# EAGLE design BPU_display-v1d.2-28inch (EAGLE 9.1.3)
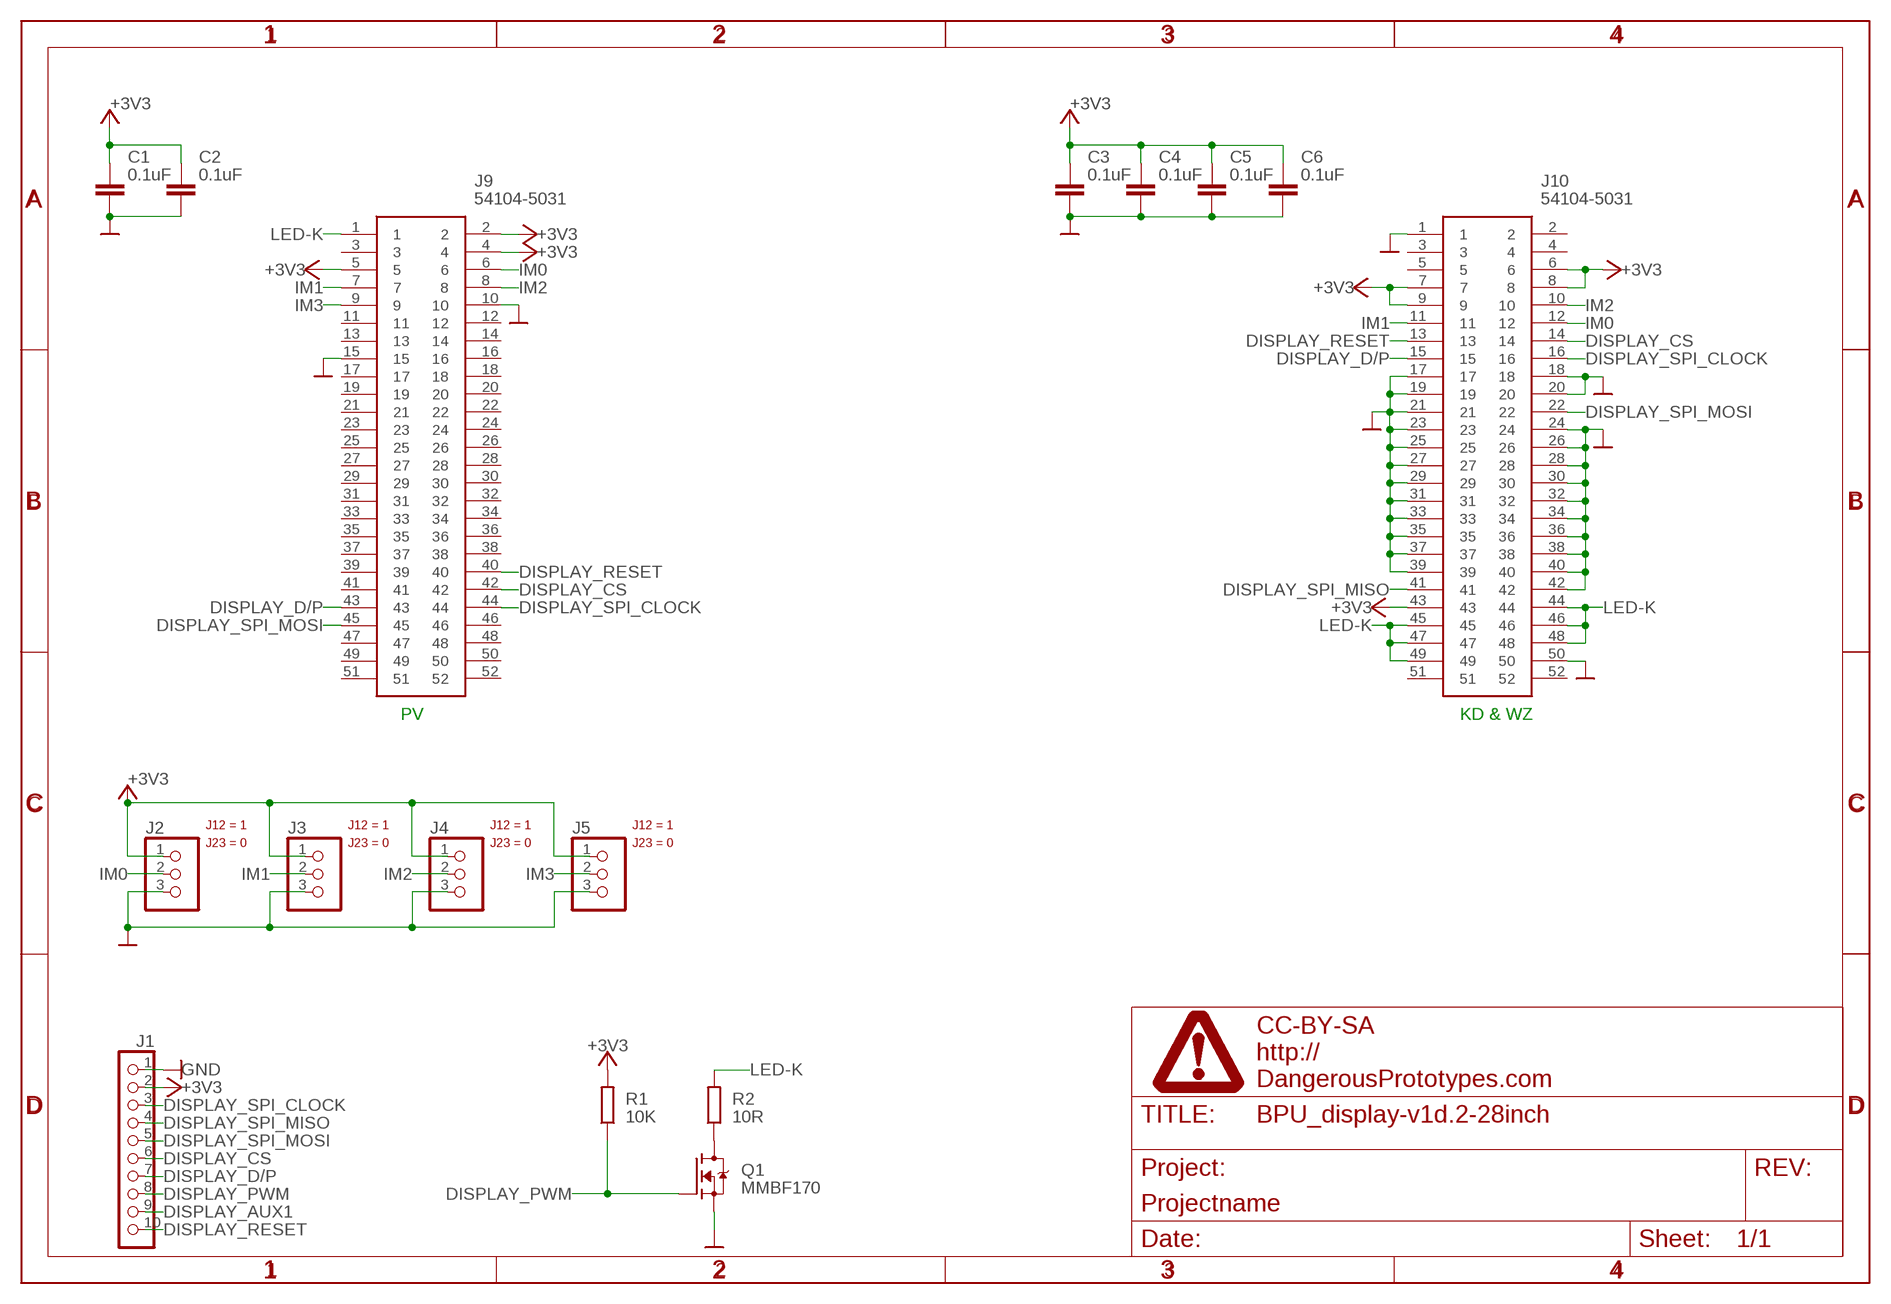
[diagram p0: schematic, sheet 1]

## Parts
C1  0.1uF  CAPACITOR_NPOL-0603  [C603]
C2  0.1uF  CAPACITOR_NPOL-0603  [C603]
C3  0.1uF  CAPACITOR_NPOL-0603  [C603]
C4  0.1uF  CAPACITOR_NPOL-0603  [C603]
C5  0.1uF  CAPACITOR_NPOL-0603  [C603]
C6  0.1uF  CAPACITOR_NPOL-0603  [C603]
J1  CON-FPC_X05B20L10T  [X05B20L10T]
J2  JUMPER_1X30805  [JP3_0805]
J3  JUMPER_1X30805  [JP3_0805]
J4  JUMPER_1X30805  [JP3_0805]
J5  JUMPER_1X30805  [JP3_0805]
J9  54104-5031  [541045031]
J10  54104-5031  [541045031]
PAGE1  FRAME_DINA4_L  [DP_LOGO]
Q1  MMBF170  TRANSISTOR_FET_BS170-SOT-23  [SOT-23]
R1  10K  R-EU_R0603  [R0603]
R2  10R  R-EU_R0603  [R0603]

## Nets
+3V3: C1.1 C2.1 C3.1 C4.1 C5.1 C6.1 J1.2 J2.1 J3.1 J4.1 J5.1 J9.2 J9.4 J9.5 J10.6 J10.7 J10.8 J10.9 J10.43 R1.2 ; supply symbol labelled SUPPLY_+3V3
DISPLAY_AUX1 [signal_digital]: J1.9
DISPLAY_CS: J1.6 J9.42 J10.14
DISPLAY_D/P: J1.7 J9.43 J10.15
DISPLAY_PWM: J1.8 Q1.1(G) R1.1
DISPLAY_RESET [signal_digital]: J1.10 J9.40 J10.13
DISPLAY_SPI_CLOCK: J1.3 J9.44 J10.16
DISPLAY_SPI_MISO: J1.4 J10.41
DISPLAY_SPI_MOSI: J1.5 J9.45 J10.22
GND: C1.2 C2.2 C3.2 C4.2 C5.2 C6.2 J1.1 J2.3 J3.3 J4.3 J5.3 J9.10 J9.15 J10.1 J10.17 J10.18 J10.19 J10.20 J10.21 J10.23 J10.24 J10.25 J10.26 J10.27 J10.28 J10.29 J10.30 J10.31 J10.32 J10.33 J10.34 J10.35 J10.36 J10.37 J10.38 J10.39 J10.40 J10.42 J10.50 Q1.2(S) ; supply symbol labelled SUPPLY_GND
IM0: J2.2 J9.6 J10.12
IM1: J3.2 J9.7 J10.11
IM2: J4.2 J9.8 J10.10
IM3: J5.2 J9.9
LED-K: J9.1 J10.44 J10.45 J10.46 J10.47 J10.48 J10.49 R2.2
N$2: Q1.3(D) R2.1
Unconnected: J9.3 J9.11 J9.12 J9.13 J9.14 J9.16 J9.17 J9.18 J9.19 J9.20 J9.21 J9.22 J9.23 J9.24 J9.25 J9.26 J9.27 J9.28 J9.29 J9.30 J9.31 J9.32 J9.33 J9.34 J9.35 J9.36 J9.37 J9.38 J9.39 J9.41 J9.46 J9.47 J9.48 J9.49 J9.50 J9.51 J9.52 J10.2 J10.3 J10.4 J10.5 J10.51 J10.52

## Notes on the sheet
- PV | KD & WZ

## Library data of the parts
C1-C6 = dp_devices.v6:CAPACITOR_NPOL: Non-Polarized capacitor in various packages
J1 = dp_devices.v6:CON-FPC_X05B20L10T: 10-pin 0.5mm pitch SMD FPC Connector X05B20L10T
J2-J5 = dp_devices.v6:JUMPER_1X3; J12: 1; J23: 0
J9 J10 = SamacSys_Parts:54104-5031: Connector 0.5mm, FFC/FPC, SMT,r/a,50w,Au Molex FFC/FPC SMT Series 0.5mm Pitch 50 Way Right Angle SMT Female FPC Connector, ZIF Top Contact Source: Datasheet <https://componentsearchengine.com/Datasheets/1/54104-5031.pdf>; DESCRIPTION: Connector 0.5mm, FFC/FPC, SMT,r/a,50w,Au Molex FFC/FPC SMT Series 0.5mm Pitch 50 Way Right Angle SMT Female FPC Connector, ZIF Top Contact; HEIGHT: 2mm; MANUFACTURER_NAME: Molex; MANUFACTURER_PART_NUMBER: 54104-5031; MOUSER_PART_NUMBER: 538-54104-5031; MOUSER_PRICE-STOCK: https://www.mouser.com/Search/Refine.aspx?Keyword=538-54104-5031
PAGE1 = dp_devices.v6:FRAME_DINA4_L: A4 DP frame Standard Dangerous Prototypes schematic frame. Automagically adds the DP logo and standard texts to the PCB Use the atrribute in the schematic editor to change the fields.; FF1: fulfillment by; FF2: Seeed Studio; FF3: www.seeedstudio.com; LICENSE: CC-BY-SA; PROJECT: Projectname; URL1: http://; URL2: DangerousPrototypes.com
Q1 = dp_devices.v6:TRANSISTOR_FET_BS170: N-Channel Enhancement Mode Field Effect Transistor
R1 R2 = rcl:R-EU_: RESISTOR, European symbol; SPICEPREFIX: R

## Net classes
1 power: width 0.305 mm
3 signal_digital: width 0.254 mm

## Board
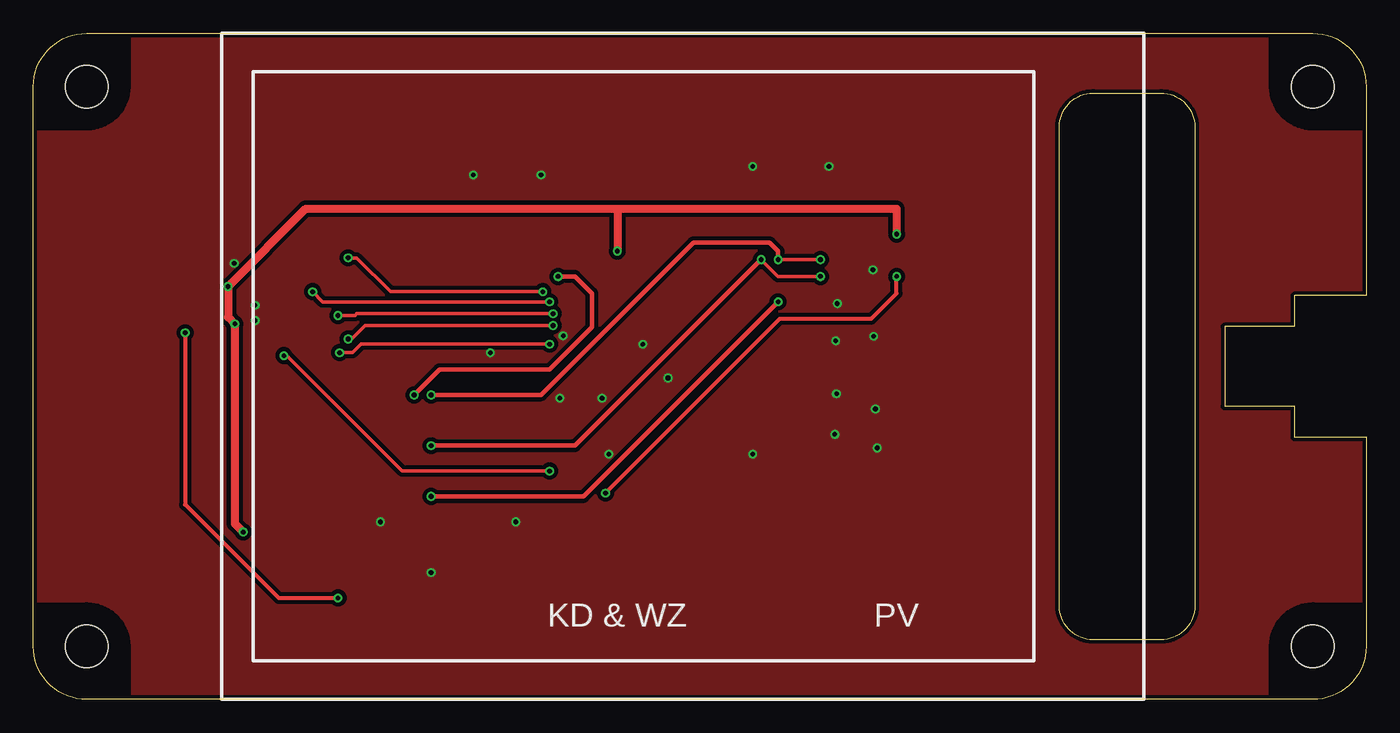
[diagram p1: board, top side]
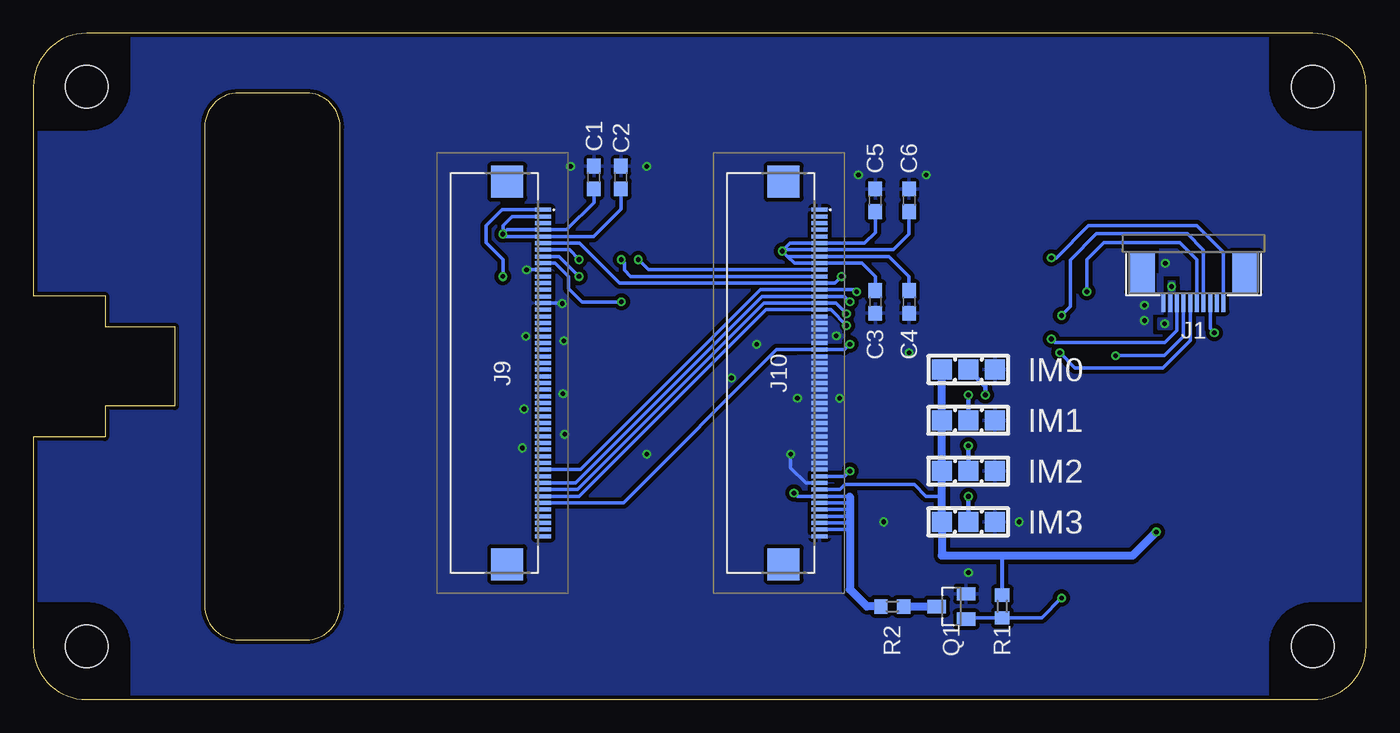
[diagram p2: board, bottom side, seen from below]

Size 100 x 50 mm. Coordinates in mm from the lower left corner, seen from the top.
Outline: 100,4 arc0 100,4
Outline: 100,4 arc-90 96,0 4,0 arc-90 0,4 0,46 arc-90 4,50 96,50 arc-90 100,46 100,30.31 94.62,30.31 94.62,27.98 89.39,27.98 89.39,22.02 94.62,22.02 94.62,19.69 100,19.69 100,4
Outline: 79.52,45.52 84.6,45.52 arc-90 87.14,42.98 87.14,7.03 arc-90 84.6,4.49 79.52,4.49 arc-90 76.98,7.03 76.98,42.98 arc-90 79.52,45.52
Copper layers (1*16): Top 0.035mm / dielectric 1.5mm / Bottom 0.035mm
Design rules "dirt_cheap_dirty_boards.v1.1": minimum track width 6mil, minimum drill 12mil, track to track 6mil, track to pad 6mil, pad to pad 6mil, via to via 6mil, smd to smd 0mil, copper to edge 10mil, drill to drill 10mil, minimum pad ring 10mil, minimum via ring 6mil, stop-mask expansion 2mil, vias tented up to drill 25mil, thermal gap 10mil
Holes 3.2 mm at 4,4 96,4 96,46 4,46
tKeepout: 7 lines
bKeepout: 8 lines
tRestrict: area 0,43 to 7,50; area 93,43 to 100,50; area 0,0 to 7,7; area 93,0 to 100,7
bRestrict: area 0,43 to 7,50; area 93,43 to 100,50; area 0,0 to 7,7; area 93,0 to 100,7
vRestrict: area 0,0 to 7,7; area 0,43 to 7,50; area 93,43 to 100,50; area 93,0 to 100,7

### Footprints (pad centres in the part's own frame; a part is rotated, then mirrored left to right if it is on the bottom)
C603 = smd 1.1 x 1: 1 -0.85,0; 2 0.85,0
X05B20L10T = smd 0.3 x 1.3: 1 2.25,2.35; 2 1.75,2.35; 3 1.25,2.35; 4 0.75,2.35; 5 0.25,2.35; 6 -0.25,2.35; 7 -0.75,2.35; 8 -1.25,2.35; 9 -1.75,2.35; 10 -2.25,2.35 | smd 2 x 3: 11 -3.9,0; 12 3.9,0
JP3_0805 = smd 1.5 x 1.5: 1 -2,0; 2 0,0; 3 2,0
541045031 = smd 0.3 x 1.2: 1 -12.25,0.4; 2 -11.75,0.4; 3 -11.25,0.4; 4 -10.75,0.4; 5 -10.25,0.4; 6 -9.75,0.4; 7 -9.25,0.4; 8 -8.75,0.4; 9 -8.25,0.4; 10 -7.75,0.4; 11 -7.25,0.4; 12 -6.75,0.4; 13 -6.25,0.4; 14 -5.75,0.4; 15 -5.25,0.4; 16 -4.75,0.4; 17 -4.25,0.4; 18 -3.75,0.4; 19 -3.25,0.4; 20 -2.75,0.4; 21 -2.25,0.4; 22 -1.75,0.4; 23 -1.25,0.4; 24 -0.75,0.4; 25 -0.25,0.4; 26 0.25,0.4; 27 0.75,0.4; 28 1.25,0.4; 29 1.75,0.4; 30 2.25,0.4; 31 2.75,0.4; 32 3.25,0.4; 33 3.75,0.4; 34 4.25,0.4; 35 4.75,0.4; 36 5.25,0.4; 37 5.75,0.4; 38 6.25,0.4; 39 6.75,0.4; 40 7.25,0.4; 41 7.75,0.4; 42 8.25,0.4; 43 8.75,0.4; 44 9.25,0.4; 45 9.75,0.4; 46 10.25,0.4; 47 10.75,0.4; 48 11.25,0.4; 49 11.75,0.4; 50 12.25,0.4 | smd 2.4 x 2.4: 51 -14.35,-2.3; 52 14.35,-2.3
SOT-23 = smd 1 x 1.4: 1 -0.95,-1.1; 2 0.95,-1.1; 3 0,1.1
R0603 = smd 1 x 1.1: 1 -0.85,0; 2 0.85,0

### Placement (x,y rotation side)
C1  57.95,39.18 90 bottom
C2  55.92,39.18 90 bottom
C3  36.83,29.84 270 bottom
C4  34.29,29.84 270 bottom
C5  36.83,37.47 90 bottom
C6  34.29,37.47 90 bottom
J1  12.95,32.08 180 bottom
J2  29.84,24.77 0 bottom
J3  29.84,20.95 0 bottom
J4  29.84,17.14 0 bottom
J5  29.84,13.34 0 bottom
J9  62.15,24.5 270 bottom
J10  41.41,24.5 270 bottom
PAGE1  42.29,-11.81 0 top  (outside the outline)
Q1  31.11,6.99 90 bottom
R1  27.3,6.99 90 bottom
R2  35.56,6.99 180 bottom

### Tracks (layer width: path | path; a pad name or v marks a point on that pad's centre or on a via)
+3V3  (via drill 0.35)
  Top 0.61: v15.75,12.57 15.11,13.21 v15.11,28.19 14.61,28.7 v14.61,30.99 20.45,36.83 42.55,36.83 43.81,36.83 | 43.81,36.83 64.77,36.83 v64.77,34.92 | 43.81,36.83 v43.81,33.66
  Bottom 0.254: C6.1 34.29,34.92 35.47,33.75 J10.7 43.72,33.75 v43.81,33.66 | C5.1 36.83,35.05 37.63,34.25 J10.6 43.22,34.25 v43.81,33.66 | C4.1 34.29,31.75 35.79,33.25 J10.8 43.41,33.25 | C3.1 36.83,31.75 37.83,32.75 J10.9 42.91,32.75 43.41,33.25 | C1.1 57.95,37.3 60,35.25 J9.4 64.44,35.25 v64.77,34.92 | C2.1 55.92,36.79 57.96,34.75 J9.5 64.59,34.75 v64.77,34.92 | 43.41,33.25 v43.81,33.66 | J9.2 64.08,36.25 64.77,35.56 v64.77,34.92 | J10.43 39.49,15.75 39.12,16.13 33.91,16.13 33.02,15.24 31.84,15.24
  Bottom 0.305: R1.2 27.3,10.79
  Bottom 0.61: v15.75,12.57 17.53,10.79 27.3,10.79 31.84,10.79 J5.1 31.84,15.24 J4.1 J3.1 J2.1
  pour Bottom (no thermals): 14.35,31.37 14.86,31.37 14.86,28.57 15.62,28.57 15.62,27.81 14.86,27.81 14.35,27.81
DISPLAY_CS  (via drill 0.35)
  Top 0.254: v38.73,29.84 21.72,29.84 v20.95,30.61
  Bottom 0.254: J9.42 59.31,16.25 45.31,30.25 J10.14 39.14,30.25 v38.73,29.84 | J1.6 12.7,33.02 13.97,34.29 19.68,34.29 20.95,33.02 v20.95,30.61
DISPLAY_D/P  (via drill 0.35)
  Top 0.254: v38.99,28.96 24.27,28.96 24.13,28.81 v22.86,28.81
  Bottom 0.254: J9.43 59.18,15.75 45.18,29.75 J10.15 39.78,29.75 v38.99,28.96 | v22.86,28.81 22.2,29.48 22.2,32.99 20.23,34.95 13.42,34.95 12.2,33.73 J1.7
DISPLAY_PWM  (via drill 0.35)
  Top 0.305: v11.39,27.52 11.39,14.64 18.41,7.62 v22.86,7.62
  Bottom 0.254: v11.39,27.52 11.7,27.83 J1.8 | Q1.1 29.91,6.13 R1.1 24.34,6.13 v22.86,7.62
DISPLAY_RESET  (via drill 0.35)
  Top 0.254: v38.23,30.61 26.8,30.61 24.26,33.15 v23.62,33.15
  Bottom 0.254: J9.40 58.95,17.25 45.45,30.75 J10.13 38.37,30.75 v38.23,30.61 | J1.10 10.7,33.56 12.7,35.56 20.83,35.56 23.24,33.15 v23.62,33.15
DISPLAY_SPI_CLOCK  (via drill 0.35)
  Top 0.254: v38.99,28.07 24.89,28.07 23.88,27.05 v23.62,27.05
  Bottom 0.254: J1.3 14.2,27.71 15.11,26.8 23.37,26.8 v23.62,27.05 | J9.44 59.05,15.25 45.05,29.25 J10.16 40.17,29.25 v38.99,28.07
DISPLAY_SPI_MISO  (via drill 0.35)
  Top 0.254: v38.73,17.14 27.69,17.14 19.02,25.81 v18.8,25.81
  Bottom 0.254: J10.41 39.13,16.75 v38.73,17.14 | v18.8,25.81 15.14,25.81 13.7,27.25 J1.4
DISPLAY_SPI_MOSI  (via drill 0.35)
  Top 0.254: v38.73,26.67 24.61,26.67 23.97,26.04 v22.99,26.04
  Bottom 0.254: J9.45 55.73,14.75 44.23,26.25 J10.22 39.16,26.25 v38.73,26.67 | J1.5 13.2,26.93 15.24,24.89 21.84,24.89 v22.99,26.04
GND  (via drill 0.35)
  Bottom 0.254: J10.42 42.04,16.25 43.18,17.39 v43.18,18.41 | J9.15 60.36,29.75 v60.33,29.72 | J9.10 v62.98,32.25 v62.99,32.26
  other vias: 16.64,29.59 15.07,32.73 16.64,28.45 59.69,40.01 60.2,26.92 53.98,40.01 39.75,27.3 39.5,22.61 34.29,26.04 63.19,21.81 38.1,39.37 33.02,39.37 63.06,27.27 60.26,22.95 63.31,18.89 60.14,19.9 29.84,9.53 26.04,13.34 36.2,13.34 53.98,18.41 47.62,24.13 45.72,26.67 42.67,22.61
  pour Top (isolate 0.305, rank 6): 0,50 100,50 100,0 0,0
  pour Bottom (isolate 0.305, rank 6): 0,50 100,50 100,0 0,0
  pour Bottom (no thermals): 15.24,31.88 16.38,31.88 16.38,28.96 15.24,28.96
  pour Bottom (no thermals): 39.37,25.78 42.67,25.78 42.67,17.27 39.37,17.27
  pour Bottom (no thermals): 39.37,28.7 42.67,28.7 42.67,26.8 39.37,26.8
IM0  (via drill 0.35)
  Top 0.356: v28.57,22.86 30.48,24.77 38.73,24.77 41.91,27.94 41.91,30.48 40.64,31.75 v39.37,31.75
  Bottom 0.254: J9.6 59.02,34.25 56.02,31.25 J10.12 39.87,31.25 v39.37,31.75
  Bottom 0.356: J2.2 28.57,23.5 v28.57,22.86
IM1  (via drill 0.35)
  Top 0.254: v59.05,33.02 v55.88,33.02
  Top 0.356: v29.84,22.86 38.1,22.86 49.53,34.29 55.24,34.29 55.88,33.66 v55.88,33.02
  Bottom 0.254: J10.11 55.19,31.75 55.65,32.22 55.65,32.79 v55.88,33.02 | J9.7 59.78,33.75 v59.05,33.02
  Bottom 0.356: J3.2 v29.84,22.86
IM2  (via drill 0.35)
  Top 0.254: v59.05,31.75 55.88,31.75 v54.61,33.02
  Top 0.356: v29.84,19.05 40.64,19.05 v54.61,33.02
  Bottom 0.254: J10.10 53.84,32.25 v54.61,33.02 | J9.8 60.55,33.25 v59.05,31.75
  Bottom 0.356: J4.2 v29.84,19.05
IM3  (via drill 0.35)
  Top 0.356: v29.84,15.24 41.27,15.24 v55.88,29.84
  Bottom 0.254: v55.88,29.84 58.84,29.84 59.85,30.86 59.85,31.75 60.85,32.75 J9.9
  Bottom 0.356: J5.2 v29.84,15.24
LED-K  (via drill 0.35)
  Top 0.305: v42.93,15.49 56.01,28.57 62.87,28.57 64.77,30.48 v64.77,31.75
  Bottom 0.254: J10.49 38.78,12.75 38.73,12.7 | J10.48 38.82,13.25 38.73,13.34 | J10.47 38.95,13.75 38.73,13.97 38.73,14.25 J10.46 | J10.45 38.73,14.75 38.73,15.24 38.73,15.25 J10.44 42.68,15.25 v42.93,15.49 | J9.1 64.85,36.75 66.04,35.56 66.04,34.29 64.77,33.02 v64.77,31.75
  Bottom 0.61: R2.2 37.47,6.99 38.73,8.26 38.73,12.7 38.73,13.34 38.73,13.97 38.73,15.24
N$2
  Bottom 0.61: R2.1 Q1.3

### Text on the board
tNames: KD & WZ | PV
bNames: IM0 | IM1 | IM2 | IM3